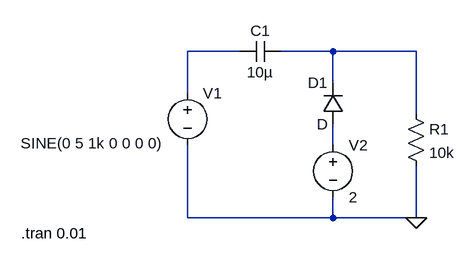
[diagram p0: schematic Clamper.asc]
Clamper.asc, the LTspice schematic file:
Version 4.1
SHEET 1 880 680
WIRE 112 64 32 64
WIRE 256 64 176 64
WIRE 384 64 256 64
WIRE 256 112 256 64
WIRE 32 128 32 64
WIRE 384 160 384 64
WIRE 256 208 256 176
WIRE 32 320 32 208
WIRE 256 320 256 288
WIRE 256 320 32 320
WIRE 384 320 384 240
WIRE 384 320 256 320
FLAG 384 320 0
SYMBOL voltage 32 112 R0
WINDOW 3 -257 93 Left 2
WINDOW 123 0 0 Left 0
WINDOW 39 0 0 Left 0
SYMATTR InstName V1
SYMATTR Value SINE(0 5 1k 0 0 0 0)
SYMBOL cap 176 48 R90
WINDOW 0 0 32 VBottom 2
WINDOW 3 32 32 VTop 2
SYMATTR InstName C1
SYMATTR Value 10µ
SYMBOL diode 272 176 R180
WINDOW 0 24 64 Left 2
WINDOW 3 24 0 Left 2
SYMATTR InstName D1
SYMBOL voltage 256 192 R0
WINDOW 123 0 0 Left 0
WINDOW 39 0 0 Left 0
SYMATTR InstName V2
SYMATTR Value 2
SYMBOL res 368 144 R0
SYMATTR InstName R1
SYMATTR Value 10k
TEXT -224 344 Left 2 !.tran 0.01

The netlist it stands for:
* Clamper.asc
V1 N001 0 SINE(0 5 1k 0 0 0 0)
C1 N002 N001 10µ
D1 N003 N002 D
V2 N003 0 2
R1 N002 0 10k
.model D D
.lib standard.dio
.tran 0.01
.backanno
.end